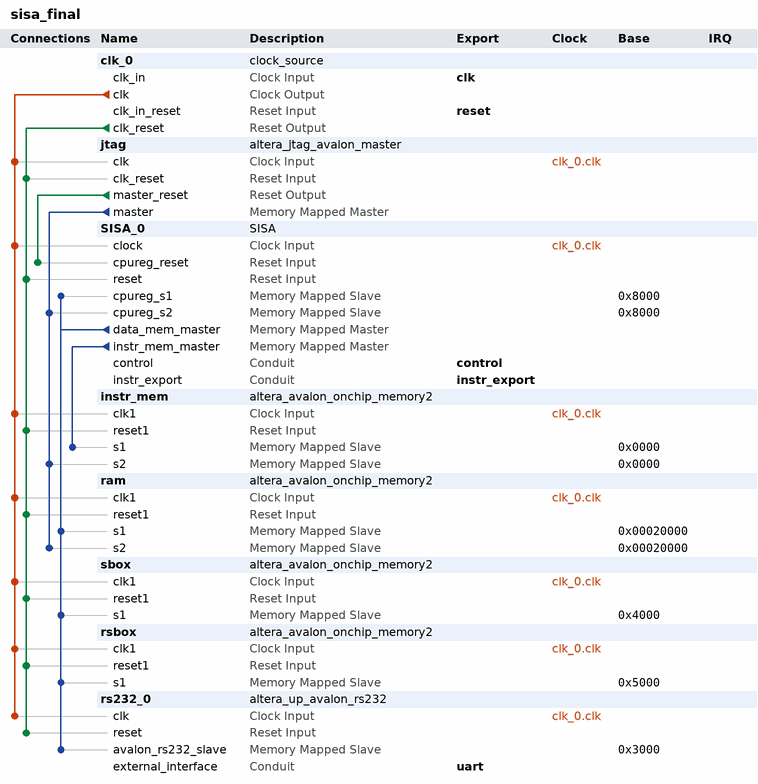
[diagram p0: system contents]
# Platform Designer (Qsys) system sisa_final, Cyclone V 5CSEMA5F31C6
# Parameters at their usual value, and those the tool derives, are not listed.
package require -exact qsys 18.1
create_system sisa_final
set_project_property DEVICE_FAMILY {Cyclone V}
set_project_property DEVICE 5CSEMA5F31C6

add_instance clk_0 clock_source 18.1
set_instance_parameter_value clk_0 clockFrequency 50000000

add_instance jtag altera_jtag_avalon_master 18.1
set_instance_parameter_value jtag FIFO_DEPTHS 32

add_instance SISA_0 SISA 1.0

add_instance instr_mem altera_avalon_onchip_memory2 18.1
set_instance_parameter_value instr_mem dataWidth 32
set_instance_parameter_value instr_mem dualPort true
set_instance_parameter_value instr_mem initMemContent true
set_instance_parameter_value instr_mem initializationFileName {C:/Users/sergi/Desktop/TEC_DRIVE/OneDrive - Estudiantes ITCR/TEC/2024/2/ARQUI II/PROYECTOS/Proyecto 1/Proyecto git final/proyecto1/software/implementacion_aes/asm/bootrom/output_files/bootrom.hex}
set_instance_parameter_value instr_mem instanceID inst
set_instance_parameter_value instr_mem memorySize 8192
set_instance_parameter_value instr_mem resetrequest_enabled false
set_instance_parameter_value instr_mem singleClockOperation true
set_instance_parameter_value instr_mem useNonDefaultInitFile true

add_instance ram altera_avalon_onchip_memory2 18.1
set_instance_parameter_value ram dataWidth 32
set_instance_parameter_value ram dualPort true
set_instance_parameter_value ram initMemContent false
set_instance_parameter_value ram initializationFileName /home/josfemova-rs/REPOSITORIES/CE4302/proyecto1/software/implementacion_aes/asm/escalar/output_files/rsbox.hex
set_instance_parameter_value ram instanceID ram
set_instance_parameter_value ram memorySize 131072
set_instance_parameter_value ram resetrequest_enabled false
set_instance_parameter_value ram singleClockOperation true

add_instance sbox altera_avalon_onchip_memory2 18.1
set_instance_parameter_value sbox dataWidth 32
set_instance_parameter_value sbox dualPort false
set_instance_parameter_value sbox initMemContent true
set_instance_parameter_value sbox initializationFileName {C:/Users/sergi/Desktop/TEC_DRIVE/OneDrive - Estudiantes ITCR/TEC/2024/2/ARQUI II/PROYECTOS/Proyecto 1/Proyecto git final/proyecto1/software/implementacion_aes/asm/escalar/output_files/sbox.hex}
set_instance_parameter_value sbox memorySize 1024
set_instance_parameter_value sbox resetrequest_enabled false
set_instance_parameter_value sbox useNonDefaultInitFile true
set_instance_parameter_value sbox writable false

add_instance rsbox altera_avalon_onchip_memory2 18.1
set_instance_parameter_value rsbox dataWidth 32
set_instance_parameter_value rsbox dualPort true
set_instance_parameter_value rsbox initMemContent true
set_instance_parameter_value rsbox initializationFileName {C:/Users/sergi/Desktop/TEC_DRIVE/OneDrive - Estudiantes ITCR/TEC/2024/2/ARQUI II/PROYECTOS/Proyecto 1/Proyecto git final/proyecto1/software/implementacion_aes/asm/escalar/output_files/rsbox.hex}
set_instance_parameter_value rsbox memorySize 1024
set_instance_parameter_value rsbox resetrequest_enabled false
set_instance_parameter_value rsbox singleClockOperation true
set_instance_parameter_value rsbox useNonDefaultInitFile true
set_instance_parameter_value rsbox writable false

add_instance rs232_0 altera_up_avalon_rs232 17.1
set_instance_parameter_value rs232_0 baud 115200
set_instance_parameter_value rs232_0 parity None

# connections
add_connection clk_0.clk instr_mem.clk1 clock
add_connection clk_0.clk jtag.clk clock
add_connection clk_0.clk ram.clk1 clock
add_connection clk_0.clk rs232_0.clk clock
add_connection clk_0.clk rsbox.clk1 clock
add_connection clk_0.clk sbox.clk1 clock
add_connection clk_0.clk SISA_0.clock clock
add_connection clk_0.clk_reset instr_mem.reset1 reset
add_connection clk_0.clk_reset jtag.clk_reset reset
add_connection clk_0.clk_reset ram.reset1 reset
add_connection clk_0.clk_reset rs232_0.reset reset
add_connection clk_0.clk_reset rsbox.reset1 reset
add_connection clk_0.clk_reset sbox.reset1 reset
add_connection clk_0.clk_reset SISA_0.reset reset
add_connection jtag.master_reset SISA_0.cpureg_reset reset
add_connection jtag.master instr_mem.s2 avalon
set_connection_parameter_value jtag.master/instr_mem.s2 baseAddress 0x0000
add_connection jtag.master ram.s2 avalon
set_connection_parameter_value jtag.master/ram.s2 baseAddress 0x00020000
add_connection jtag.master SISA_0.cpureg_s2 avalon
set_connection_parameter_value jtag.master/SISA_0.cpureg_s2 baseAddress 0x8000
add_connection SISA_0.data_mem_master ram.s1 avalon
set_connection_parameter_value SISA_0.data_mem_master/ram.s1 baseAddress 0x00020000
add_connection SISA_0.data_mem_master rs232_0.avalon_rs232_slave avalon
set_connection_parameter_value SISA_0.data_mem_master/rs232_0.avalon_rs232_slave baseAddress 0x3000
add_connection SISA_0.data_mem_master rsbox.s1 avalon
set_connection_parameter_value SISA_0.data_mem_master/rsbox.s1 baseAddress 0x5000
add_connection SISA_0.data_mem_master sbox.s1 avalon
set_connection_parameter_value SISA_0.data_mem_master/sbox.s1 baseAddress 0x4000
add_connection SISA_0.data_mem_master SISA_0.cpureg_s1 avalon
set_connection_parameter_value SISA_0.data_mem_master/SISA_0.cpureg_s1 baseAddress 0x8000
add_connection SISA_0.instr_mem_master instr_mem.s1 avalon
set_connection_parameter_value SISA_0.instr_mem_master/instr_mem.s1 baseAddress 0x0000

# exported interfaces
add_interface clk clock sink
set_interface_property clk EXPORT_OF clk_0.clk_in
add_interface control conduit end
set_interface_property control EXPORT_OF SISA_0.control
add_interface instr_export conduit end
set_interface_property instr_export EXPORT_OF SISA_0.instr_export
add_interface reset reset sink
set_interface_property reset EXPORT_OF clk_0.clk_in_reset
add_interface uart conduit end
set_interface_property uart EXPORT_OF rs232_0.external_interface

set_interconnect_requirement {$system} qsys_mm.clockCrossingAdapter HANDSHAKE
set_interconnect_requirement {$system} qsys_mm.enableEccProtection FALSE
set_interconnect_requirement {$system} qsys_mm.insertDefaultSlave FALSE
set_interconnect_requirement {$system} qsys_mm.maxAdditionalLatency 1

save_system sisa_final.qsys
